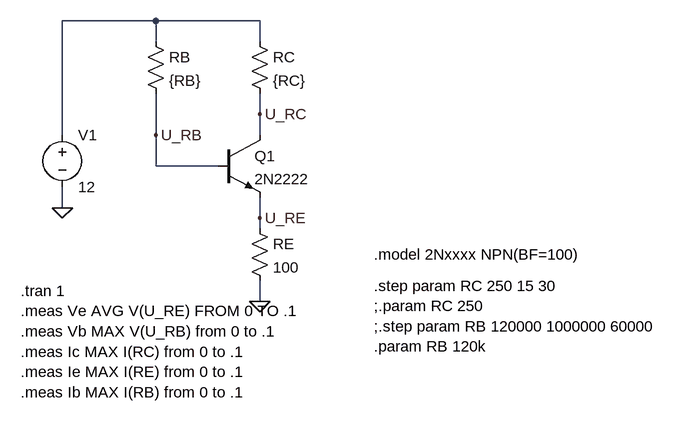
[diagram p0: schematic bias1.asc]
bias1.asc, the LTspice schematic file:
Version 4.1
SHEET 1 4212 680
WIRE 192 -48 48 -48
WIRE 352 -48 192 -48
WIRE 192 -16 192 -48
WIRE 352 -16 352 -48
WIRE 352 96 352 64
WIRE 48 128 48 -48
WIRE 192 128 192 64
WIRE 352 128 352 96
WIRE 192 176 192 128
WIRE 288 176 192 176
WIRE 48 240 48 208
WIRE 352 256 352 224
WIRE 352 272 352 256
WIRE 352 384 352 352
FLAG 352 384 0
FLAG 48 240 0
FLAG 352 96 U_RC
FLAG 352 256 U_RE
FLAG 192 128 U_RB
SYMBOL voltage 48 112 R0
WINDOW 123 0 0 Left 0
WINDOW 39 0 0 Left 0
SYMATTR InstName V1
SYMATTR Value 12
SYMBOL npn 288 128 R0
SYMATTR InstName Q1
SYMATTR Value 2N2222
SYMBOL res 176 -32 R0
SYMATTR InstName RB
SYMATTR Value {RB}
SYMBOL res 336 -32 R0
SYMATTR InstName RC
SYMATTR Value {RC}
SYMBOL res 336 256 R0
SYMATTR InstName RE
SYMATTR Value 100
TEXT -16 368 Left 2 !.tran 1\n.meas Ve AVG V(U_RE) FROM 0 TO .1\n.meas Vb MAX V(U_RB) from 0 to .1\n.meas Ic MAX I(RC) from 0 to .1\n.meas Ie MAX I(RE) from 0 to .1\n.meas Ib MAX I(RB) from 0 to .1
TEXT 528 312 Left 2 !.model 2Nxxxx NPN(BF=100)
TEXT 528 360 Left 2 !.step param RC 250 15 30\n;.param RC 250\n;.step param RB 120000 1000000 60000\n.param RB 120k

The netlist it stands for:
* bias1.asc
V1 N001 0 12
Q1 U_RC U_RB U_RE 0 2N2222
RB N001 U_RB {RB}
RC N001 U_RC {RC}
RE U_RE 0 100
.model NPN NPN
.model PNP PNP
.lib standard.bjt
.tran 1
.meas Ve AVG V(U_RE) FROM 0 TO .1
.meas Vb MAX V(U_RB) from 0 to .1
.meas Ic MAX I(RC) from 0 to .1
.meas Ie MAX I(RE) from 0 to .1
.meas Ib MAX I(RB) from 0 to .1
.model 2Nxxxx NPN(BF=100)
.step param RC 250 15 30
;.param RC 250
;.step param RB 120000 1000000 60000
.param RB 120k
.backanno
.end